# EAGLE design Schematic (EAGLE 8.0.0)
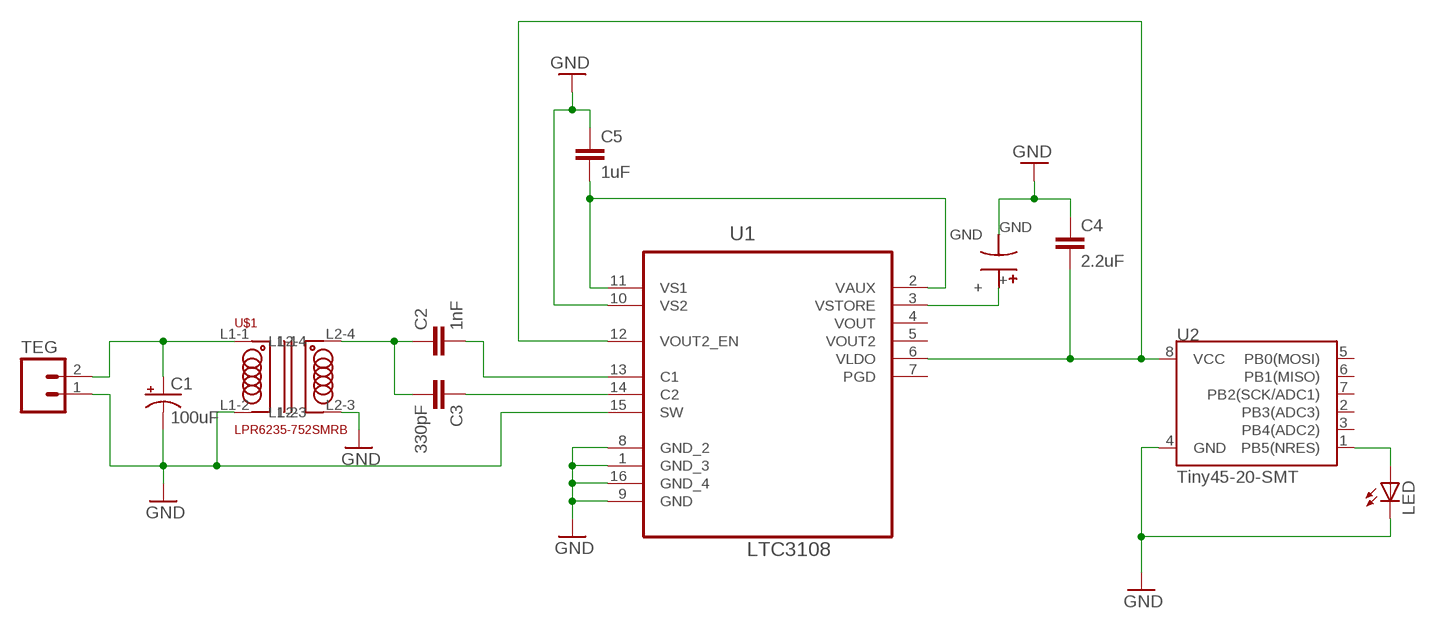
[diagram p0: schematic, sheet 1]

## Parts
C1  100uF  10UF-16V-10%(TANT)  [EIA3216]
C2  1nF  CAP0603-CAP  [0603-CAP]
C3  330pF  CAP0603-CAP  [0603-CAP]
C4  2.2uF  CAP0603-CAP  [0603-CAP]
C5  1uF  CAP0603-CAP  [0603-CAP]
C6  FC0V104FTBR24  [FC0V104ZFTBR24]
LED  LEDCHIPLED_0805  [CHIPLED_0805]
TEG  M02LOCK  [1X02_LOCK]
U1  LTC3108  LTC3108IGNPBF  [SOP63P600X175-16N]
U2  Tiny45-20-SMT  ATTINY45TINY45-20-SMT  [SO08-EIAJ]
U$1  LPR6235-752SMRB  [LPR6235-752SMRB]

## Nets
GND: C1.C(-) C4.1 C5.1 C6.GND LED.C TEG.1 U1.1(GND_3) U1.8(GND_2) U1.9(GND) U1.10(VS2) U1.15(SW) U1.16(GND_4) U2.4(GND) U$1.L1-2 U$1.L2-3
N$1: C2.1 C3.2 U$1.L2-4
N$2: C5.2 U1.2(VAUX) U1.11(VS1)
N$3: C2.2 U1.13(C1)
N$4: C3.1 U1.14(C2)
N$6: C6.+ U1.3(VSTORE)
N$7: C4.2 U1.6(VLDO) U1.12(VOUT2_EN) U2.8(VCC)
N$8: LED.A U2.1(PB5(NRES))
N$9: C1.A(+) TEG.2 U$1.L1-1
Unconnected: U1.4(VOUT) U1.5(VOUT2) U1.7(PGD) U2.2(PB3(ADC3)) U2.3(PB4(ADC2)) U2.5(PB0(MOSI)) U2.6(PB1(MISO)) U2.7(PB2(SCK/ADC1))

## Library data of the parts
C1 = SparkFun-Capacitors:10UF-16V-10%(TANT): CAP-00811 1206/EIA-3216 Tantalum capacitor; PROD_ID: CAP-00811; VALUE: 10uF
C2-C5 = SparkFun-Capacitors:CAP: Capacitor Standard 0603 ceramic capacitor, and 0.1" leaded capacitor.
C6 = JeffThompson_ORIG:FC0V104FTBR24: 0.1F 3.5V supercapacitor Kemet FC0V104ZFTBR24 https://content.kemet.com/datasheets/KEM_S6011_FC.pdf
LED = adafruit:LED: LED OSRAM: - CHIPLED LG R971, LG N971, LY N971, LG Q971, LY Q971, LO R971, LY R971 LH N974, LH R974 LS Q976, LO Q976, LY Q976 LO Q996 - Hyper CHIPLED LW Q18S LB Q993, LB Q99A, LB R99A - SideLED LS A670, LO A670, LY A670, LG A670, LP A670 LB A673, LV A673, LT A673, LW A673 LH A674 LY A675 LS A676, LA A676, LO A676, LY A676, LW A676 LS A679, LY A679, LG A679 - Hyper Micro SIDELED® LS Y876, LA Y876, LO Y876, LY Y876 LT Y87S - SmartLED LW L88C, LW L88S LB L89C, LB L89S, LG L890 LS L89K, LO L89K, LY L89K LS L896, LA L896, LO L896, LY L896 - TOPLED LS T670, LO T670, LY T670, LG T670, LP T670 LSG T670, LSP T670, LSY T670, LOP T670, LYG T670 LG T671, LOG T671, LSG T671 LB T673, LV T673, LT T673, LW T673 LH T674 LS T676, LA T676, LO T676, LY T676, LB T676, LH T676, LSB T676, LW T676 LB T67C, LV T67C, LT T67C, LS T67K, LO T67K, LY T67K, LW E67C LS E67B, LA E67B, LO E67B, LY E67B, LB E67C, LV E67C, LT E67C LW T67C LS T679, LY T679, LG T679 LS T770, LO T770, LY T770, LG T770, LP T770 LB T773, LV T773, LT T773, LW T773 LH T774 LS E675, LA E675, LY E675, LS T675 LS T776, LA T776, LO T776, LY T776, LB T776 LHGB T686 LT T68C, LB T68C - Hyper Mini TOPLED® LB M676 - Mini TOPLED Santana® LG M470 LS M47K, LO M47K, LY M47K Source: http://www.osram.convergy.de/
TEG = SparkFun-Connectors:M02: Standard 2-pin 0.1" header. Use with - straight break away headers ( PRT-00116) - right angle break away headers (PRT-00553) - swiss pins (PRT-00743) - machine pins (PRT-00117) - female headers (PRT-00115) Molex polarized connector foot print use with: PRT-08233 with associated crimp pins and housings. 2.54_SCREWTERM for use with PRT-10571. 3.5mm Screw Terminal footprints for PRT-08084 5mm Screw Terminal footprints for use with PRT-08433
U1 = LTC:LTC3108IGNPBF: Ultralow Voltage Step-Up Converter and Power Manager; MPN: LTC3108IGN#PBF; OC_FARNELL: 1799834; OC_NEWARK: 67R4280; PACKAGE: SSOP-16; SUPPLIER: Linear Technology
U2 = SparkFun-DigitalIC:ATTINY45: Atmel 8-pin 2/4/8kB flash uC; PROD_ID: IC-08922
U$1 = JeffThompson_ORIG:LPR6235-752SMRB: Coilcraft 100:1 SMD transformer LPR6235-752SMRB https://www.mouser.com/ds/2/597/Coilcraft_lpr6235-1214787.pdf

## Board
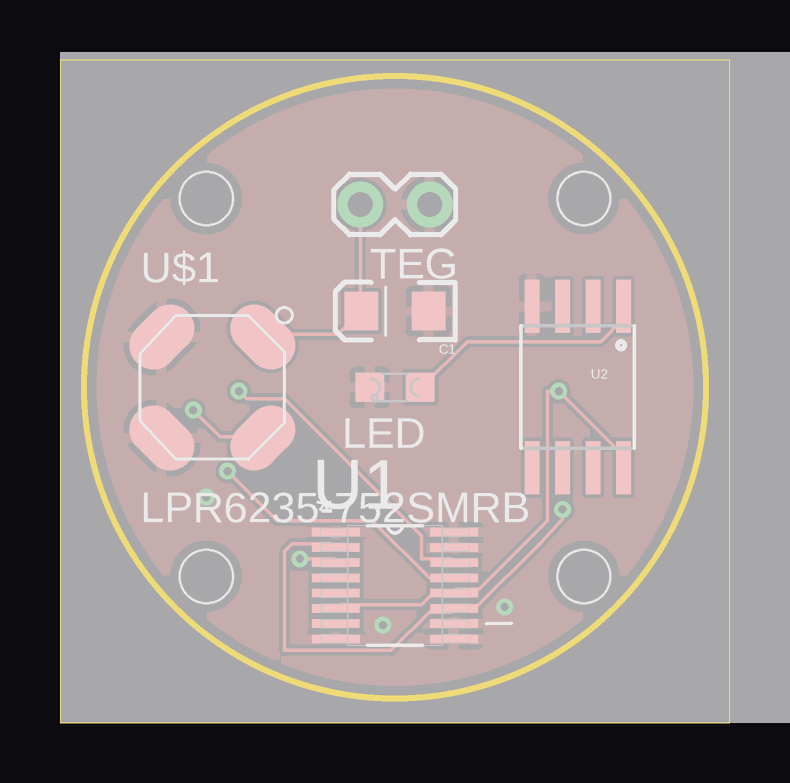
[diagram p1: board, top side]
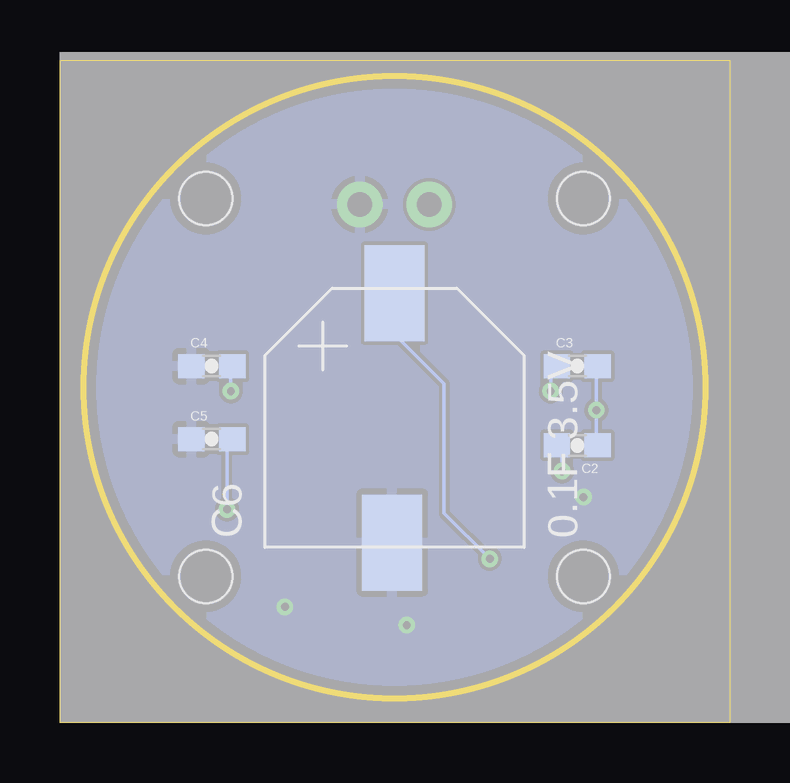
[diagram p2: board, bottom side, seen from below]

Size 27.92 x 27.61 mm. Coordinates in mm from the lower left corner, seen from the top.
Outline: 0,0 27.92,0 27.92,27.61 0,27.61 0,0
Outline: circle at 13.97,13.97 radius 12.95
Copper layers (1*16): Top 0.0356mm / dielectric 1.5011mm / Bottom 0.0356mm
Design rules "OSHPark": minimum track width 6mil, minimum drill 13mil, track to track 6mil, track to pad 6mil, pad to pad 6mil, via to via 6mil, smd to smd 6mil, copper to edge 15mil, drill to drill 6mil, minimum pad ring 7mil, minimum via ring 7mil, stop-mask expansion 4mil, vias tented up to drill 0mil, thermal gap 10mil
Holes 2.21 mm at 6.1,21.84 6.1,6.1 21.84,21.84 21.84,6.1

### Footprints (pad centres in the part's own frame; a part is rotated, then mirrored left to right if it is on the bottom)
EIA3216 = smd 1.4 x 1.6: A 1.4,0; C -1.4,0
0603-CAP = smd 1.1 x 1: 1 -0.85,0; 2 0.85,0
FC0V104ZFTBR24 = smd 2.5 x 4: + 0,5.2; GND -0.1,-5.2
CHIPLED_0805 = smd 1.2 x 1.2: A 0,-1.05; C 0,1.05
1X02_LOCK = drill 1.016 pad 1.88: 1 -0.178,0; 2 2.718,0
SOP63P600X175-16N = smd 1.981 x 0.356: 1 -2.464,2.235; 2 -2.464,1.575; 3 -2.464,0.965; 4 -2.464,0.305; 5 -2.464,-0.305; 6 -2.464,-0.965; 7 -2.464,-1.575; 8 -2.464,-2.235; 9 2.464,-2.235; 10 2.464,-1.575; 11 2.464,-0.965; 12 2.464,-0.305; 13 2.464,0.305; 14 2.464,0.965; 15 2.464,1.575; 16 2.464,2.235
SO08-EIAJ = smd 0.61 x 2.21: 1 -1.905,-3.378; 2 -0.635,-3.378; 3 0.635,-3.378; 4 1.905,-3.378; 5 1.905,3.353; 6 0.635,3.353; 7 -0.635,3.353; 8 -1.905,3.353
LPR6235-752SMRB = smd 3 x 2 rotated 45: L1-1 -2.105,2.105; L2-3 2.105,-2.105 | smd 2 x 3 rotated 45: L1-2 -2.105,-2.105; L2-4 2.105,2.105

### Placement (x,y rotation side)
C1  13.97,17.14 180 top
C2  6.35,11.56 180 bottom
C3  6.35,14.86 0 bottom
C4  21.59,14.86 0 bottom
C5  21.59,11.81 0 bottom
C6  13.97,12.7 0 bottom
LED  13.97,13.97 90 top
TEG  15.24,21.59 180 top
U1  13.97,5.71 0 top
U2  21.59,13.97 180 top
U$1  6.35,13.97 270 top

### Tracks (layer width: path | path; a pad name or v marks a point on that pad's centre or on a via)
GND  (via drill 0.33)
  other vias: 6.1,9.4 13.46,4.06 18.54,4.83
  pour Bottom: -2.54,27.94 27.94,27.94 27.94,0 -2.54,0
  pour Top: -1.27,27.94 29.21,27.94 29.21,0 -1.27,0
N$1  (via drill 0.33)
  Top 0.152: v5.56,13.02 6.67,11.91 8.41,11.91 U$1.L2-4
  Bottom 0.152: C2.1 5.56,11.59 v5.56,13.02 5.56,14.76 C3.2
N$2  (via drill 0.33)
  Top 0.152: v20.95,8.89 20.95,8.48 20,7.46 17.3,4.76 16.51,4.76 U1.11 16.35,4.6 15.4,4.6 13.81,3.02 9.37,3.02 9.37,7.14 9.68,7.46 11.27,7.46 11.43,7.3 U1.2
  Bottom 0.152: v20.95,8.89 20.95,11.59 20.8,11.75 C5.2
N$3  (via drill 0.33)
  Top 0.152: v6.98,10.48 9.05,8.41 13.02,8.41 15.4,6.03 16.35,6.03 U1.13
  Bottom 0.152: v6.98,10.48 6.98,11.27 7.14,11.43 C2.2
N$4  (via drill 0.33)
  Top 0.152: v7.46,13.81 7.78,13.49 9.37,13.49 15.08,7.78 15.08,6.83 16.35,6.83 U1.14
  Bottom 0.152: v7.46,13.81 7.46,14.61 7.3,14.76 C3.1
N$6  (via drill 0.33)
  Top 0.152: v10,6.83 11.43,6.83 U1.3
  Bottom 0.152: v10,6.83 11.91,8.73 11.91,14.13 13.97,16.19 C6.+
N$7  (via drill 0.33)
  Top 0.152: U1.6 11.59,4.76 11.75,4.92 15.08,4.92 15.56,5.4 16.35,5.4 U1.12 16.51,5.56 17.46,5.56 20.32,8.41 20.32,13.81 v20.8,13.81 23.5,11.11 U2.8
  Bottom 0.152: v20.8,13.81 20.8,14.76 C4.2
N$8
  Top 0.152: U2.1 23.5,16.83 22.54,15.88 16.99,15.88 15.08,13.97 LED.A
N$9
  Top 0.152: 12.54,17.14 11.59,16.19 8.57,16.19 U$1.L1-1 | 12.54,17.14 12.54,21.59 TEG.2 | 12.54,17.14 C1.A